# EAGLE design Main_Board_2X-SOLAR_5V-DCDC (EAGLE 8.2.2)
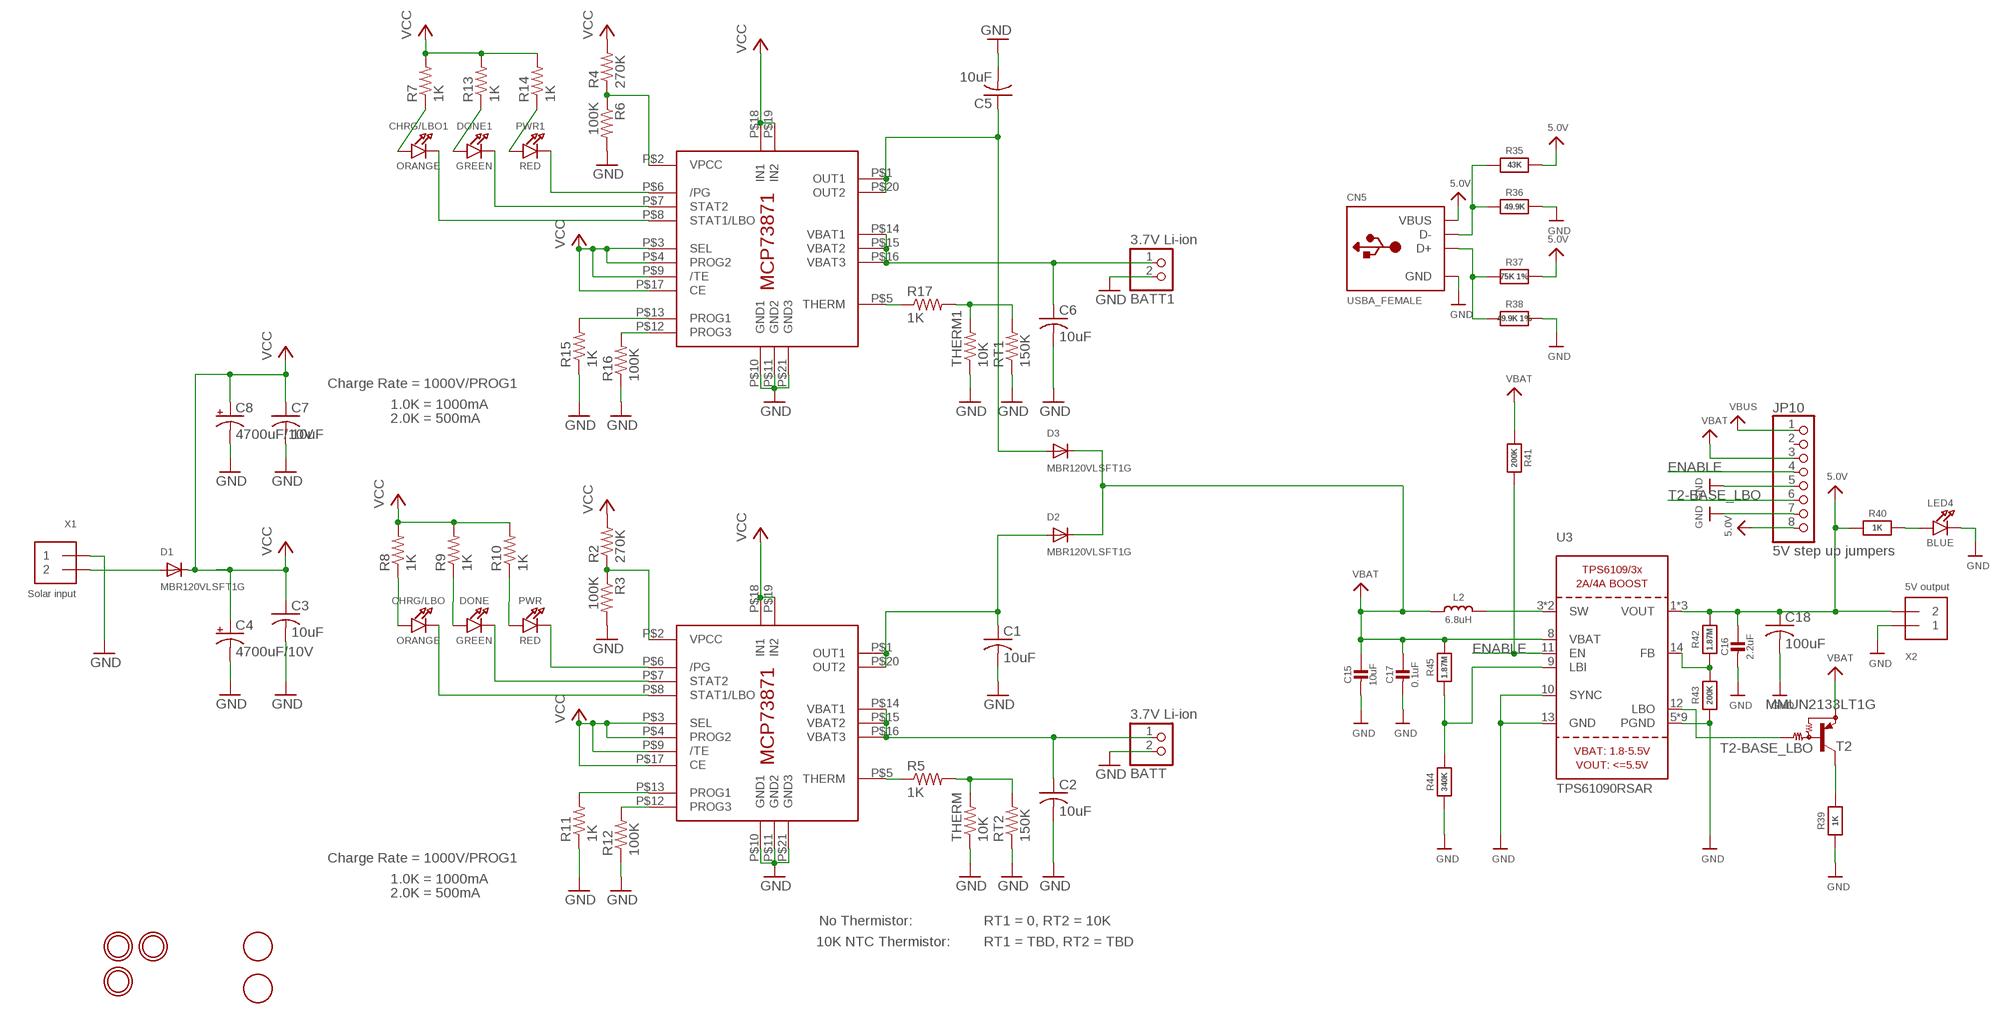
[diagram p0: schematic, sheet 1]

## Parts
BATT  3.7V Li-ion  JST_2PIN-SMT-RA  [JST-PH-2-SMT-RA]
BATT1  3.7V Li-ion  JST_2PIN-SMT-RA  [JST-PH-2-SMT-RA]
C1  10uF  C-USC0805K  [C0805K]
C2  10uF  C-USC0805K  [C0805K]
C3  10uF  C-USC0805K  [C0805K]
C4  4700uF/10V  CPOL-USE5-13  [E5-13]
C5  10uF  C-USC0805K  [C0805K]
C6  10uF  C-USC0805K  [C0805K]
C7  10uF  C-USC0805K  [C0805K]
C8  4700uF/10V  CPOL-USE5-13  [E5-13]
C15  10uF  CAP_CERAMIC0805-NOOUTLINE  [0805-NO]
C16  2.2uF  CAP_CERAMIC0805-NOOUTLINE  [0805-NO]
C17  0.1uF  CAP_CERAMIC0805_10MGAP  [0805_10MGAP]
C18  100uF  C-USC1210  [C1210]
CHRG/LBO  ORANGE  LED0805_NOOUTLINE  [CHIPLED_0805_NOOUTLINE]
CHRG/LBO1  ORANGE  LED0805_NOOUTLINE  [CHIPLED_0805_NOOUTLINE]
CN5  USBA_FEMALE  USB_TYPEAPTHFML  [USB_HOST-PTH]
D1  MBR120VLSFT1G  DIODESOD-123  [SOD-123]
D2  MBR120VLSFT1G  DIODESOD-123  [SOD-123]
D3  MBR120VLSFT1G  DIODESOD-123  [SOD-123]
DONE  GREEN  LED0805_NOOUTLINE  [CHIPLED_0805_NOOUTLINE]
DONE1  GREEN  LED0805_NOOUTLINE  [CHIPLED_0805_NOOUTLINE]
IC1  MCP73871  [QFN20_4MM]
IC2  MCP73871  [QFN20_4MM]
JP10  5V step up jumpers  HEADER-1X8ROUND  [1X08_ROUND]
L2  6.8uH  INDUCTORTDK_VLC5045  [INDUCTOR_5X5MM_TDK_VLC5045]
LED4  BLUE  LED0805_NOOUTLINE  [CHIPLED_0805_NOOUTLINE]
PWR  RED  LED0805_NOOUTLINE  [CHIPLED_0805_NOOUTLINE]
PWR1  RED  LED0805_NOOUTLINE  [CHIPLED_0805_NOOUTLINE]
R2  270K  R-US_R0805  [R0805]
R3  100K  R-US_R0805  [R0805]
R4  270K  R-US_R0805  [R0805]
R5  1K  R-US_M0805  [M0805]
R6  100K  R-US_R0805  [R0805]
R7  1K  R-US_R0805  [R0805]
R8  1K  R-US_R0805  [R0805]
R9  1K  R-US_R0805  [R0805]
R10  1K  R-US_R0805  [R0805]
R11  1K  R-US_FLIPFLOP  [0805-THM]
R12  100K  R-US_R0805  [R0805]
R13  1K  R-US_R0805  [R0805]
R14  1K  R-US_R0805  [R0805]
R15  1K  R-US_FLIPFLOP  [0805-THM]
R16  100K  R-US_R0805  [R0805]
R17  1K  R-US_M0805  [M0805]
R35  43K  RESISTOR0805_NOOUTLINE  [0805-NO]
R36  49.9K  RESISTOR0805_NOOUTLINE  [0805-NO]
R37  75K 1%  RESISTOR0805_NOOUTLINE  [0805-NO]
R38  49.9K 1%  RESISTOR0805_NOOUTLINE  [0805-NO]
R39  1K  RESISTOR0805_NOOUTLINE  [0805-NO]
R40  1K  RESISTOR0805_NOOUTLINE  [0805-NO]
R41  200K  RESISTOR0805_NOOUTLINE  [0805-NO]
R42  1.87M  RESISTOR0805_NOOUTLINE  [0805-NO]
R43  200K  RESISTOR0805_NOOUTLINE  [0805-NO]
R44  340K  RESISTOR_0805MP  [_0805MP]
R45  1.87M  RESISTOR_0805MP  [_0805MP]
RT1  150K  R-US_M0805  [M0805]
RT2  150K  R-US_M0805  [M0805]
T2  MMUN2133LT1G  MUN2114T1-PNP_DRIVER-SC59-BEC  [SC59-BEC]
THERM  10K  R-US_FLIPFLOP  [0805-THM]
THERM1  10K  R-US_FLIPFLOP  [0805-THM]
U3  TPS61090RSAR  VREG_TPS6103X  [PVQFN-16]
U$1  MOUNTINGHOLE2.5  [MOUNTINGHOLE_2.5_PLATED]
U$3  FIDUCIAL  [FIDUCIAL_1MM]
U$4  MOUNTINGHOLE2.5  [MOUNTINGHOLE_2.5_PLATED]
U$6  MOUNTINGHOLE2.5  [MOUNTINGHOLE_2.5_PLATED]
U$8  FIDUCIAL  [FIDUCIAL_1MM]
X1  Solar input  TERMBLOCK_1X2  [TERMBLOCK_1X2-3.5MM]
X2  5V output  TERMBLOCK_1X2  [TERMBLOCK_1X2-3.5MM]

## Nets
5.0V: C16.1 C18.1 CN5.VBUS JP10.8 R35.2 R37.2 R40.1 R42.2 U3.1(VOUT) U3.15(VOUT) U3.16(VOUT) X2.2
BATT: BATT.1 C2.1 IC1.P$14(VBAT1) IC1.P$15(VBAT2) IC1.P$16(VBAT3)
BATT1: BATT1.1 C6.1 IC2.P$14(VBAT1) IC2.P$15(VBAT2) IC2.P$16(VBAT3)
D+1: CN5.D+ R37.1 R38.1
D-1: CN5.D- R35.1 R36.1
ENABLE: JP10.4 R41.2 U3.11(EN)
GND: BATT1.2 BATT.2 C1.2 C2.2 C3.2 C4.- C5.2 C6.2 C7.2 C8.- C15.2 C16.2 C17.2 C18.2 CN5.GND IC1.P$10(GND1) IC1.P$11(GND2) IC1.P$21(GND3) IC2.P$10(GND1) IC2.P$11(GND2) IC2.P$21(GND3) JP10.5 JP10.7 LED4.C R3.2 R6.2 R11.1 R12.1 R15.1 R16.1 R36.2 R38.2 R39.1 R43.1 R44.1 RT1.1 RT2.1 THERM1.1 THERM.1 U3.5(PGND) U3.6(PGND) U3.7(PGND) U3.10(SYNC) U3.13(GND) U3.P$18(PGND) U3.P$19(PGND) U3.P$20(PGND) U3.P$21(PGND) U3.P$22(PGND) U3.THERMAL(PGND) X1.1 X2.1
LBI: R44.2 R45.1 U3.9(LBI)
N$5: IC1.P$5(THERM) R5.1
N$8: R5.2 RT2.2 THERM.2
N$12: CHRG/LBO.A R8.1
N$13: DONE.A R9.1
N$14: PWR.A R10.1
N$19: CHRG/LBO1.A R7.1
N$20: DONE1.A R13.1
N$21: PWR1.A R14.1
N$24: IC2.P$5(THERM) R17.1
N$25: R17.2 RT1.2 THERM1.2
N$42: R42.1 R43.2 U3.14(FB)
N$44: LED4.A R40.2
PG: IC1.P$6(/PG) PWR.C
PG_1: IC2.P$6(/PG) PWR1.C
PROG1: IC1.P$13(PROG1) R11.2
PROG1_1: IC2.P$13(PROG1) R15.2
PROG3: IC1.P$12(PROG3) R12.2
PROG3_1: IC2.P$12(PROG3) R16.2
PV_IN: D1.A X1.2
STAT1: CHRG/LBO.C IC1.P$8(STAT1/LBO)
STAT1_1: CHRG/LBO1.C IC2.P$8(STAT1/LBO)
STAT2: DONE.C IC1.P$7(STAT2)
STAT2_1: DONE1.C IC2.P$7(STAT2)
SW: L2.P$2 U3.3(SW) U3.4(SW)
T2-BASE_LBO: JP10.6 T2.B U3.12(LBO)
T2-DRAIN: R39.2 T2.C
VBAT: C15.1 C17.1 D2.C D3.C JP10.3 L2.P$1 R41.1 R45.2 T2.E U3.8(VBAT)
VBUS: JP10.1
VCC: C3.1 C4.+ C7.1 C8.+ D1.C IC1.P$3(SEL) IC1.P$4(PROG2) IC1.P$9(/TE) IC1.P$17(CE) IC1.P$18(IN1) IC1.P$19(IN2) IC2.P$3(SEL) IC2.P$4(PROG2) IC2.P$9(/TE) IC2.P$17(CE) IC2.P$18(IN1) IC2.P$19(IN2) R2.2 R4.2 R7.2 R8.2 R9.2 R10.2 R13.2 R14.2
VOUT: C1.1 D2.A IC1.P$1(OUT1) IC1.P$20(OUT2)
VOUT1: C5.1 D3.A IC2.P$1(OUT1) IC2.P$20(OUT2)
VPCC: IC1.P$2(VPCC) R2.1 R3.1
VPCC1: IC2.P$2(VPCC) R4.1 R6.1
Unconnected: JP10.2

## Notes on the sheet
- Charge Rate = 1000V/PROG1
- 1.0K = 1000mA
- 2.0K = 500mA
- Charge Rate = 1000V/PROG1
- 1.0K = 1000mA
- 2.0K = 500mA
- No Thermistor: | RT1 = 0, RT2 = 10K
- 10K NTC Thermistor: | RT1 = TBD, RT2 = TBD

## Library data of the parts
BATT BATT1 = adafruit:JST_2PIN: JST 2-Pin Connectors of various flavors SMT-RA (S2B-PH-SM4) 4UConnector #17311 SMT (B2B-PH-SM4) THM-RA (S2B-PH) THM (B2B-PH)
C1-C3 C5-C7 = adafruit:C-US: CAPACITOR, American symbol
C4 C8 = adafruit:CPOL-US: POLARIZED CAPACITOR, American symbol
C15-C17 = microbuilder:CAP_CERAMIC: Ceramic Capacitors For new designs, use the packages preceded by an '_' character since they are more reliable: The following footprints should be used on most boards: _0402 - Standard footprint for regular board layouts _0603 - Standard footprint for regular board layouts _0805 - Standard footprint for regular board layouts _1206 - Standard footprint for regular board layouts For extremely tight-pitch boards where space is at a premium, the following 'micro-pitch' footprints can be used (smaller pads, no silkscreen outline, etc.): _0402MP - Micro-pitch footprint for very dense/compact boards _0603MP - Micro-pitch footprint for very dense/compact boards _0805MP - Micro-pitch footprint for very dense/compact boards _1206MP - Micro-pitch footprint for very dense/compact boards
C18 = rcl:C-US: CAPACITOR, American symbol
CHRG/LBO CHRG/LBO1 DONE DONE1 LED4 PWR PWR1 = microbuilder:LED: LED 0603 - 0603 Surface Mount Package 2mA: Green LED - Low Power (3.9mcd, 2ma, 1.7Vf) - Digikey: 475-2709-2-ND Orange LED - Low Power (9.8mcd, 2ma, 1.8Vf) - Digikey: 475-1194-2-ND Red LED - Low Power (5mcd, 2ma, 1.8Vf) - Digikey: 475-1195-2-ND Yellow LED - Low Power (7mcd, 2ma, 1.8Vf) - Digikey: 475-1196-2-ND 5mA: Blue LED - Low Power (17mcd, 5ma, 2.9Vf) - Digikey: LNJ937W8CRACT-ND 0805 - 0805 Surface Mount Package 2mA: Red LED (8.8mcd, 2mA, 1.8Vf, Clear) - Low Power [Digikey: 475-2510-1-ND] Green LED (5mcd, 2mA, 1.8Vf, Clear) - Low Power [Digikey: 475-2730-1-ND] Yellow LED (11.3mcd, 2mA, 1.8Vf, Clear) - Low Power [Digikey: 475-2555-1-ND] 20mA: Red LED (104mcd, 20mA, Diffused) - LS R976 [Digikey: 475-1278-6-ND] Red LED (12mcd, 20mA, 2.0Vf, Clear) - APT2012EC [Digikey: 754-1128-1-ND] Green LED (15mcd, 20mA, 2.2Vf, Clear) - APT2012GC [Digikey: 754-1131-1-ND] Orange LED (160mcd, 20mA, 2.1Vf, Clear) - APT2012SECK [Digikey: 754-1130-1-ND] 1206 - 1206 Surface Mount Package Green LED (26mcd, 20mA, Diffused) - LG N971 [Digikey: 475-1407-6-ND] Red LED (15mcd, 20mA, Diffused) - LH N974 [Digikey: 475-1416-6-ND] Cree - Cree High-Power Surface Mount LEDs XPEBWT-L1-0000-00D50 - White 111lm 350mA 2.9Vf 6200K 110° XTEAWT-00-0000-00000LEE3 - White 114lm 350mA 2.85Vf 5000K 115° Everlight - Everlight 45-21 Series Surface Mount LEDs 45-21/QK2C-B2832AC2CB2/2T - Warm White 2000mcd 20mA 3.25Vf 3050K 120° 45-21/LK2C-B38452C4CB2/2T - Nuetral White 2000mcd 20mA 3.25Vf 4150K 120° 45-21/LK2C-B50634C6CB2/2T - Cold White 2200mcd 20mA 3.25Vf 5650K 120° PLCC2 Reverse Mount LS T77K-J1L2-1-0-2-R18-Z - Red 11.25mcd 2mA 1.8Vf 630nm 120° LO T77K-L1M2-24-Z - Orange 19.6mcd 2mA 1.8Vf 606nm 120° LY T77K-K2M1-26-Z - Yellow 15.7mcd 2mA 1.8Vf 587nm 120°
CN5 = microbuilder:USB_TYPEA: USB - Type A Connectors Male types stick out and are inserted into a PC or matching females parts (these are the connectors used on USB Memory Sticks, etc.). Female parts are generally used for USB Host and accept a male-type connector. SMT - 4UCON: 10017 PTHFML - Digikey: 609-1045-ND, 4UCon: 05241 PCB - Use 2.0mm thick PCBs with this footprint
D1-D3 = microbuilder:DIODE: Diode SMA Model Volts Amps Type Vf Vr Digikey # Notes SSA34-E3 40V 3A Schottky 480mV @ 3A 200uA @ 40V SSA34-E3/61TGITR-ND CDBA120-G 20V 1A Schottky 500mV @ 1A 500uA @ 20V 641-1014-6-ND REEL MBRA210 10V 2A Schottky 350mV @ 2A 700uA @ 10V MBRA210LT3 SOD-123 Model Volts Amps Type Vf Vr Order # Notes BAT54T1G 30V 200mA Schottky 800mV @ 200mA 2uA @ 25V BAT54T1GOSTR-ND B0530W 30V 500mA Schottky 430mV @ 500mA 130uA @ 30V B0530W-FDICT-ND REEL MBR120 20V 1A Schottky 340mV @ 1A MBR120VLSFT1GOSCT-ND SOD-323 Model Volts Amps Type Vf Vr Order # Notes PMEG2005EJ 20V 500mA Schottky 355mV @ 500mA 568-4110-1-ND ZLLS410 10V 570mA Schottky 380mV @ 570mA ZLLS410CT-ND 1N4148WS 75V 150mA Silicon/Simple 1V 1N4148WSFSCT-ND REEL SOD-523 Model Volts Amps Type Vf Vr Order # Notes BAT54XV2 30V 200mA Schottky 0.8V @ 100mA BAT54XV2CT-ND TB751S 30V 30mA Schottky RB751S-40TE61CT-ND SOT23-R/W (R = Solder Paste/Reflow Ovens, W = Hand-Soldering) Model Volts Amps Type Vf Vr Order # Notes BAT54FILM 40V 300mA Schottky 497-7162-1-ND
IC1 IC2 = adafruit:MCP73871
JP10 = microbuilder:HEADER-1X8: PIN HEADER
L2 = microbuilder:INDUCTOR: Inductors 0603: 10nH Ceramic Inductor - microwire antenna/RF (Digikey: 712-1434-2-ND) 0805: 560nH Ceramic Inductor - RF (Digikey: 553-1047-1-ND) 270nH Ceramic Inductor - Q = 40@250MHz, +-5%, 1 Ohm DC Resistance (Digikey: 535-10506-2-ND) 1007 (2518 Metric) SMT: 10µH 10% 250mOhm 820mA 1007 Inductor (Digikey: 587-2189-1-ND) 22µH 10% 500mOhm 580mA 1007 Inductor (Digikey: 587-2190-1-ND) 47µH 10% 950mOhm 420mA 1007 Inductor (Digikey: 587-2191-1-ND) 47µH 5% 100mOhm 1A 1008 Inductor (Digikey: 732-1816-1-ND) 5.0x5.0mm (Taiyo Yuden NR5040 Series) 6.8µH 20% 2.3A 64mOhm Inductor (Digikey: 587-2374-2-ND) 5.0x5.0mm (TDK VLC5045 Series) 4.7µH 20% 3.3A 34mOhm Inductor (Digikey: 445-6526-1-ND) 6.8µH 20% 2.7A 46mOhm Inductor (Digikey: 445-6527-1-ND) 6.0x6.0mm (TDK VLC6045 Series) 4.7µH 20% 3.8A 27mOhm Inductor (Digikey: 445-6538-2-ND) 6.8µH 20% 3A 41mOhm Inductor (Digikey: 445-6540-1-ND) 6.2µH 30% 2.2A 45mOhm Inductor (Digikey: SRR5028-6R2YCT-ND) - Not TDK VLC6045 but footprint should match 6.0x6.0mm (TDK SLF6045 Series) 6.8uH 30% 2A 33mOhm Inductor (Digikey: 445-4572-1-ND, Mouser: 810-SLF645T6R8N2R0PF) 6.0x6.0mm (Sumida CDRH5D28 Series) 6.2uH 30% 1.8A 45mOhm Inductor (Digikey: 308-1542-1-ND) Taiyo Yuden NR3015T2R2M - 2.2uH 20% 1.5A (Digikey: 587-1648-2-ND, Mouser: 963-NR3015T2R2M) - Used with TI TPS62172 CoilCraft RFID Transponder Coil - MA5532-AE (For use with AS3935 Lightning Sensor) Vishay IHLP 1.0uH Molded Inductor - 24mOhm DCR, 5A, +/-20%, -55°C-125°C (Digikey: 541-1319-1-ND)
R2-R17 RT1 RT2 THERM THERM1 = adafruit:R-US_: RESISTOR, American symbol
R35-R45 = microbuilder:RESISTOR: Resistors For new designs, use the packages preceded by an '_' character since they are more reliable: The following footprints should be used on most boards: _0402 - Standard footprint for regular board layouts _0603 - Standard footprint for regular board layouts _0805 - Standard footprint for regular board layouts _1206 - Standard footprint for regular board layouts For extremely tight-pitch boards where space is at a premium, the following 'micro-pitch' footprints can be used (smaller pads, no silkscreen outline, etc.): _0402MP - Micro-pitch footprint for very dense/compact boards _0603MP - Micro-pitch footprint for very dense/compact boards _0805MP - Micro-pitch footprint for very dense/compact boards _1206MP - Micro-pitch footprint for very dense/compact boards
T2 = transistor:*-PNP_DRIVER-: PNP Bias Resistor Transistor
U3 = microbuilder:VREG_TPS6103X: TPS6103x 4A Boost - 1.8-5.5V Input, Adjustable Output to 5.5V
U$1 U$4 U$6 = microbuilder:MOUNTINGHOLE: Mounting Hole For #2 screws (0.086"/2.18mm width, 0.094"/2.4mm hole) use 2.5mm
U$3 U$8 = adafruit:FIDUCIAL: For use by pick and place machines to calibrate the vision/machine, 1mm By microbuilder.eu
X1 X2 = microbuilder:TERMBLOCK_1X2: 3.5mm Terminal block http://www.ladyada.net/library/pcb/eaglelibrary.html

## Net classes
0 default: clearance 0.205 mm

## Board
Rainforest Connection Power Board Rev 1
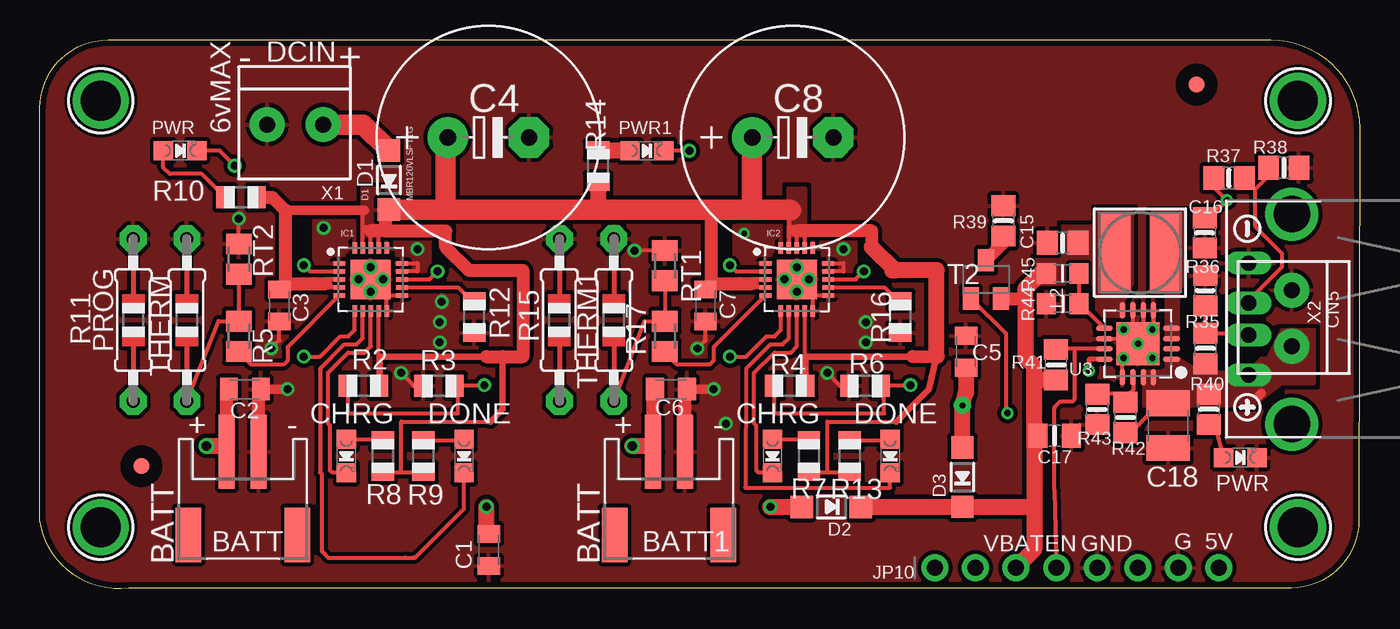
[diagram p1: board, top side]
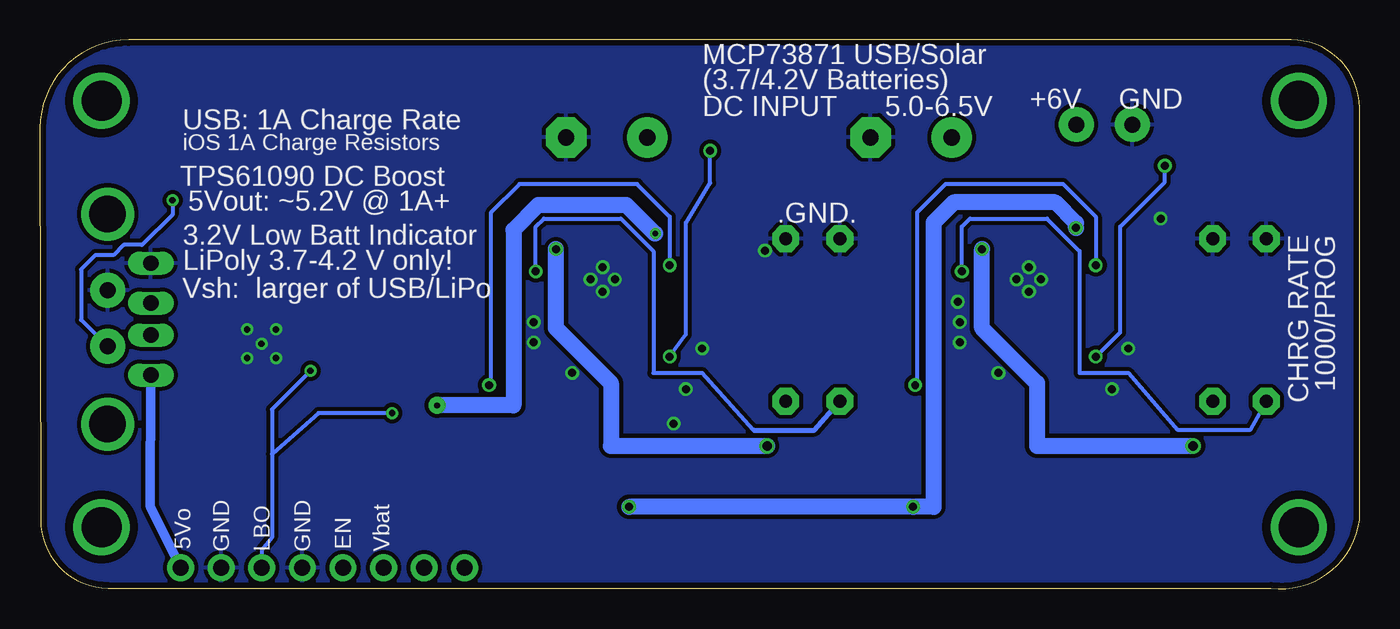
[diagram p2: board, bottom side, seen from below]

Size 82.59 x 34.33 mm. Coordinates in mm from the lower left corner, seen from the top.
Outline: 0,4.31 0,30.08 arc-90 4.27,34.33 77.05,34.33 arc-90 82.59,28.81 82.55,4.31 arc-90 78.32,0.04 5.54,0.04 arc-90 0,4.31
Copper layers (1*16): Top 0.0356mm / dielectric 1.5011mm / Bottom 0.0356mm
Design rules "oshpark-2layer": minimum track width 6mil, minimum drill 13mil, track to track 6mil, track to pad 6mil, pad to pad 6mil, via to via 6mil, smd to smd 6mil, copper to edge 15mil, drill to drill 6mil, minimum pad ring 7mil, minimum via ring 7mil, stop-mask expansion 2.5mil, vias tented up to drill 0mil, thermal gap 10mil
tRestrict: area 18.5,19 to 18.9,19.2; area 45.2,19 to 45.6,19.2; 18 lines

### Footprints (pad centres in the part's own frame; a part is rotated, then mirrored left to right if it is on the bottom)
JST-PH-2-SMT-RA = smd 1 x 4.6: 1 1,-3.7; 2 -1,-3.7 | smd 1.6 x 3.4: NC1 -3.4,1.5; NC2 3.4,1.5
C0805K = smd 1.1 x 1.4: 1 -1,0; 2 1,0
E5-13 = drill 1.016 pad 2.54: + -2.54,0 | drill 1.016 pad 2.54 octagon: - 2.54,0
0805-NO = smd 1.3 x 1.5: 1 -0.95,0; 2 0.95,0
0805_10MGAP = smd 1.2 x 1.5: 1 -1.05,0; 2 1.05,0
C1210 = smd 1.6 x 2.7: 1 -1.4,0; 2 1.4,0
CHIPLED_0805_NOOUTLINE = smd 1.2 x 1.2: A 0,-1.05; C 0,1.05
USB_HOST-PTH = drill 0.95 long: D+ 1,6.52; D- -1,6.52; GND 3.5,6.52; VBUS -3.5,6.52 | drill 2.3 pad 2.9: S1 -6.57,3.81; S2 6.57,3.81
SOD-123 = smd 1.4 x 1.4: A 1.85,0; C -1.85,0
QFN20_4MM = smd 0.73 x 0.28: P$1 -1.965,1; P$2 -1.965,0.5; P$3 -1.965,0; P$4 -1.965,-0.5; P$5 -1.965,-1; P$11 1.965,-1; P$12 1.965,-0.5; P$13 1.965,0; P$14 1.965,0.5; P$15 1.965,1 | smd 0.28 x 0.73: P$6 -1,-1.965; P$7 -0.5,-1.965; P$8 0,-1.965; P$9 0.5,-1.965; P$10 1,-1.965; P$16 1,1.965; P$17 0.5,1.965; P$18 0,1.965; P$19 -0.5,1.965; P$20 -1,1.965 | smd 2.5 x 2.5: P$21 0,0
1X08_ROUND = drill 1 pad 1.676: 1 -8.89,0; 2 -6.35,0; 3 -3.81,0; 4 -1.27,0; 5 1.27,0; 6 3.81,0; 7 6.35,0; 8 8.89,0
INDUCTOR_5X5MM_TDK_VLC5045 = smd 2 x 5: P$1 -1.6,0; P$2 1.6,0
R0805 = smd 1.1 x 1.4: 1 -1,0; 2 1,0
M0805 = smd 1.3 x 1.6: 1 -0.95,0; 2 0.95,0
0805-THM = drill 0.813 pad 1.676 octagon: 1 -5.08,0; 2 5.08,0
_0805MP = smd 1.2 x 1.3: 1 -1.016,0; 2 1.016,0
SC59-BEC = smd 1 x 1.4: B -0.95,-1.2; C 0,1.2; E 0.95,-1.2
PVQFN-16 = smd 1.05 x 0.35: 1 -2.1,0.975; 2 -2.1,0.325; 3 -2.1,-0.325; 4 -2.1,-0.975; 9 2.1,-0.975; 10 2.1,-0.325; 11 2.1,0.325; 12 2.1,0.975 | smd 0.35 x 1.05: 5 -0.975,-2.1; 6 -0.325,-2.1; 7 0.325,-2.1; 8 0.975,-2.1; 13 0.975,2.1; 14 0.325,2.1; 15 -0.325,2.1; 16 -0.975,2.1 | drill 0.4: P$18 0,0; P$19 -0.9,0.9; P$20 0.9,0.9; P$21 0.9,-0.9; P$22 -0.9,-0.9 | smd 2.7 x 2.7: THERMAL 0,0
MOUNTINGHOLE_2.5_PLATED = drill 2.5 pad 3.2: P$1 0,0
FIDUCIAL_1MM = smd 1 x 1: 1 0,0
TERMBLOCK_1X2-3.5MM = drill 1 pad 2.184: 1 1.8,0; 2 -1.7,0

### Placement (x,y rotation side)
BATT  12.7,4.86 180 top
BATT1  39.37,4.86 180 top
C1  28.09,2.43 270 top
C2  12.83,12.48 0 top
C3  14.99,17.72 270 top
C4  28.07,28.23 0 top
C5  57.96,14.82 90 top
C6  39.5,12.48 0 top
C7  41.66,17.72 270 top
C8  47.12,28.23 0 top
C15  64.01,21.63 180 top
C16  72.9,22.26 270 top
C17  63.5,9.56 0 top
C18  70.61,10.2 270 top
CHRG/LBO  19.18,8.29 180 top
CHRG/LBO1  45.85,8.29 180 top
CN5  82.17,16.87 90 top
D1  21.84,25.56 90 top
D2  49.53,5.12 180 top
D3  57.73,6.97 90 top
DONE  26.54,8.29 180 top
DONE1  53.21,8.29 180 top
IC1  20.7,19.34 0 top
IC2  47.37,19.34 0 top
JP10  64.9,1.31 0 top
L2  68.85,21.02 0 top
LED4  75.12,8.2 270 top
PWR  8.78,27.4 270 top
PWR1  37.99,27.39 270 top
R2  20.26,12.69 0 top
R3  24.97,12.69 180 top
R4  46.93,12.69 0 top
R5  12.45,15.79 90 top
R6  51.64,12.69 180 top
R7  48.13,8.29 270 top
R8  21.46,8.29 270 top
R9  24,8.29 270 top
R10  12.59,24.48 0 top
R11  5.84,16.8 270 top
R12  27.18,17.01 90 top
R13  50.67,8.29 270 top
R14  34.94,26.44 270 top
R15  32.51,16.8 270 top
R16  53.85,17.01 90 top
R17  39.12,15.79 90 top
R35  72.95,15.02 270 top
R36  72.93,18.64 90 top
R37  74.42,25.69 180 top
R38  77.85,26.33 0 top
R39  60.29,23.01 270 top
R40  73.15,11.21 270 top
R41  63.59,14.01 90 top
R42  67.94,10.71 270 top
R43  66.17,11.21 90 top
R44  64.01,17.82 0 top
R45  64.01,19.72 180 top
RT1  39.12,20.21 270 top
RT2  12.45,20.61 270 top
T2  59.21,19.34 0 top
THERM  9.19,16.8 270 top
THERM1  35.92,16.8 270 top
U3  68.72,15.32 180 top
U$1  78.74,30.52 0 top
U$3  72.39,31.53 0 top
U$4  3.81,3.85 0 top
U$6  3.81,30.52 0 top
U$8  6.35,7.66 0 top
U$12  MOUNTINGHOLE2.5  [MOUNTINGHOLE_2.5_PLATED]  78.74,3.85 0 top
U$86  [SYMBOL_PLUS]  75.56,11.34 0 top
U$87  [SYMBOL_MINUS]  75.56,22.52 90 top
X1  16.03,29.04 180 top
X2  78.36,16.87 90 top

### Tracks (layer width: path | path; a pad name or v marks a point on that pad's centre or on a via)
5.0V  (via drill 0.39)
  Top 0.254: 76.83,13.5 76.58,13.5 76.45,13.37 CN5.VBUS | R37.2 73.47,25.12 v74.3,24.29 73.21,23.21 C16.1 | R42.2 68.27,9.76 69.47,10.96 69.97,10.96 C18.1
  Top 0.61: 76.33,12.1 76.45,12.23
  Bottom 0.254: v74.3,24.29 74.3,23.41 76.2,21.5 77.34,21.5 77.98,20.87 79.12,20.87 80.01,19.98 80.01,16.82 X2.2
  Bottom 0.61: JP10.8 75.69,5.15 CN5.VBUS
  pour Top (isolate 0.254, no thermals): 69.09,13.63 69.09,11.47 75.95,11.47 77.72,12.86 79.76,12.86 79.76,16.17 77.72,16.17 76.83,14.39 76.45,14.39 75.56,13.5 72.64,13.5 71.25,14.39 70.48,14.39 70.48,13.63
BATT  (via drill 0.5, 0.6)
  Top 0.254: v23.62,21.25 23.62,21.5 | IC1.P$14 23.61,19.84 23.62,19.85 23.62,20.36 22.68,20.36 IC1.P$15
  Top 0.813: BATT.1 11.7,12.48 C2.1
  Top 1.016: v10.41,8.93 11.34,8.93 BATT.1
  Bottom 1.016: v23.62,21.25 23.62,16.29 20.19,12.86 20.19,8.93 v10.41,8.93
  pour Top: 21.72,21.25 21.72,22.26 24.38,22.26 24.38,19.85 22.35,19.85 22.35,21.25
BATT1  (via drill 0.5, 0.6)
  Top 0.254: v50.29,21.25 50.29,21.5 | IC2.P$14 50.28,19.84 50.29,19.85 50.29,20.36 49.35,20.36 IC2.P$15
  Top 0.813: BATT1.1 38.37,12.48 C6.1
  Top 1.016: v37.08,8.93 38.01,8.93 BATT1.1
  Bottom 1.016: v50.29,21.25 50.29,16.29 46.86,12.86 46.86,8.93 v37.08,8.93
  pour Top: 48.39,21.25 48.39,22.26 51.05,22.26 51.05,19.85 49.02,19.85 49.02,21.25
D+1
  Top 0.254: CN5.D+ 75.65,18.03 77.72,20.1 77.72,20.99 76.07,22.64 76.07,24.99 | R37.1 76.07,24.99 | R38.1 76.9,25.82 76.07,24.99
D-1
  Top 0.254: R36.1 72.93,15.99 R35.1 75.54,15.97 CN5.D-
ENABLE
  Top 0.254: U3.11 64.77,15 | 64.77,15 63.64,15 R41.2 | JP10.4 63.5,6.13 63.5,11.34 63.88,11.72 64.64,11.72 64.77,11.85 64.77,15
GND  (via drill 0.5)
  Top 0.254: 21.7,18.34 IC1.P$11 | IC1.P$10 21.7,18.31 | 21.7,18.31 21.72,18.33 | 22.65,13.45 v22.61,13.5 23.42,12.69 R3.2 | C3.2 14.99,15.53 v14.48,15.02 | RT2.1 v12.45,23.15 | 21.7,18.31 21.43,18.58 v20.7,18.58 | 48.37,18.34 IC2.P$11 | IC2.P$10 48.37,18.31 | 48.37,18.31 48.39,18.33 | 49.32,13.45 v49.28,13.5 50.09,12.69 R6.2 | C7.2 41.66,15.53 v41.15,15.02 | RT1.1 v37.21,21.14 | 48.37,18.31 48.1,18.58 v47.37,18.58 | U3.13 67.75,14.19 67.94,14.39 67.86,14.39 U3.P$20 | U3.10 68.06,15.65 68.07,15.66 67.82,15.91 U3.P$21 67.89,16.29 68.33,16.29 68.4,16.36 U3.7 | U3.6 69.05,16.08 69.22,15.91 | U3.5 69.7,16.3 U3.P$22
  Top 0.406: IC1.P$21 v21.46,19.34 | IC2.P$21 v48.13,19.34
  Top 0.61: C2.2 v15.49,12.48 | C6.2 v42.16,12.48
  Top 0.813: BATT.2 13.7,12.48 C2.2 | BATT1.2 40.37,12.48 C6.2
  other vias: 25.02,15.4 25.02,16.67 25.15,17.94 20.7,20.1 19.94,19.34 51.69,15.4 51.69,16.67 42.93,10.32 47.37,20.1 46.61,19.34
  pour Bottom (isolate 0.254): 0,0.04 0,34.33 82.55,34.33 82.55,0.04
  pour Top: 21.72,18.33 27.81,18.33 27.81,15.15 21.72,15.15
  pour Top: 48.39,18.33 54.48,18.33 54.48,15.15 48.39,15.15
  pour Top (isolate 0.254, rank 2): 0,-0.09 0,34.33 82.55,34.33 82.55,0.04
LBI
  Top 0.254: R45.1 R44.2 65.39,17.45 65.47,17.45 U3.9
N$5
  Top 0.254: IC1.P$5 15.49,15.1 15.49,14.26 15.24,14.01 13.21,14.01 12.45,14.77 R5.1
N$8
  Top 0.254: RT2.2 R5.2 11.18,16.74 THERM.2
N$12
  Top 0.254: CHRG/LBO.A 21.41,9.34 R8.1
N$13
  Top 0.254: R9.1 26.49,9.29 DONE.A
N$14
  Top 0.254: R10.1 10.13,25.95 8.13,25.95 7.73,26.34 PWR.A
N$19
  Top 0.254: CHRG/LBO1.A 48.08,9.34 R7.1
N$20
  Top 0.254: R13.1 53.16,9.29 DONE1.A
N$21
  Top 1.016: R14.1 36.9,27.44 PWR1.A
N$24
  Top 0.254: IC2.P$5 42.16,15.1 42.16,14.26 41.91,14.01 39.88,14.01 39.12,14.77 R17.1
N$25
  Top 0.254: RT1.2 R17.2 37.85,16.74 THERM1.2
N$42
  Top 0.254: 68.2,12.23 68.45,12.48 68.45,13.17 U3.14 | R43.2 66.17,12.23 68.2,12.23 | R42.1 67.94,11.98 68.2,12.23
N$44
  Top 0.254: R40.2 73.53,10.26 LED4.A
PG  (via drill 0.5)
  Top 0.254: v12.19,26.45 11.24,27.4 PWR.C | v16.51,14.52 17.53,14.52 18.8,15.79 19.3,15.79 19.7,16.18 IC1.P$6
  Bottom 0.254: v16.51,14.52 14.99,16.04 14.99,22.64 12.19,25.44 v12.19,26.45
PG_1  (via drill 0.5)
  Top 0.254: v40.64,27.39 PWR1.C | v43.18,14.52 44.2,14.52 45.47,15.79 45.97,15.79 46.37,16.18 IC2.P$6
  Bottom 0.254: v43.18,14.52 42.16,15.91 42.16,22.9 40.64,25.39 v40.64,27.39
PROG1  (via drill 0.5)
  Top 0.254: IC1.P$13 24.38,19.34 v24.89,19.85
  Bottom 0.254: v24.89,19.85 24.89,22.64 24.38,23.15 19.56,23.15 17.53,21.12 17.53,13.5 14.48,13.5 11.4,9.94 6.83,9.94 R11.2
PROG1_1  (via drill 0.5)
  Top 0.254: IC2.P$13 51.05,19.34 v51.56,19.85
  Bottom 0.254: v51.56,19.85 51.56,22.64 51.05,23.15 46.23,23.15 44.2,21.12 44.2,13.5 41.15,13.5 37.92,9.92
  Bottom 0.305: 37.92,9.92 34.11,9.92 R15.2
PROG3
  Top 0.254: IC1.P$12 26.17,18.84 27,18.01 R12.2
PROG3_1
  Top 0.254: IC2.P$12 52.84,18.84 53.67,18.01 R16.2
PV_IN
  Top 1.27: X1.2 20.22,29.04 D1.A
STAT1
  Top 0.254: IC1.P$8 20.7,15.15 20.32,14.77 19.3,14.77 18.03,13.5 18.03,10.32 18.16,10.2 18.16,7.4 18.29,7.28 19.14,7.28 CHRG/LBO.C 19.02,7.08
STAT1_1
  Top 0.254: IC2.P$8 47.37,15.15 46.99,14.77 45.97,14.77 44.7,13.5 44.7,10.32 44.83,10.2 44.83,7.4 44.96,7.28 45.81,7.28 CHRG/LBO1.C 45.69,7.08
STAT2
  Top 0.254: IC1.P$7 20.2,15.67 19.81,15.28 19.05,15.28 17.53,13.75 17.53,7.28 17.65,7.15 17.65,2.32 18.03,1.94 22.86,1.94 23.37,1.94 23.5,1.94 26.54,4.99 DONE.C
STAT2_1
  Top 0.254: IC2.P$7 46.87,15.67 46.48,15.28 45.72,15.28 44.2,13.75 44.15,6.31 53.21,6.31 DONE1.C
SW
  pour Top (isolate 0.254, no thermals): 70.48,15.66 71.25,15.66 71.25,18.58 71.5,18.96 71.5,23.53 69.6,23.53 69.6,18.58 70.48,18.58
T2-BASE_LBO  (via drill 0.39)
  Top 0.254: v65.66,13.63 65.9,13.63 | v60.55,10.98 60.46,10.99 60.45,15.99 T2.B
  Top 0.305: U3.12 65.66,14.35 v65.66,13.63
  Bottom 0.254: v65.66,13.63 68.07,11.21 68.07,8.42 | 68.07,8.42 68.07,3.21 68.71,2.4 JP10.6 | v60.55,10.98 65.15,10.98 68.07,8.42
T2-DRAIN
  Top 0.813: R39.2 60.24,21.56 T2.C
VBAT
  Top 0.813: 62.21,5.12 62.23,5.12 | T2.E 61.35,18.14 61.68,17.82
  Top 1.016: 62.23,10.2 62.23,12.74 | 62.23,8.93 62.23,10.2 | 62.23,8.93 62.23,5.12 62.23,2.45 JP10.3 | 62.23,12.74 62.23,13.91 61.68,14.46 61.68,17.82 61.68,18.76 62.64,19.72 R45.2 | D2.C 55.12,5.12 D3.C 62.21,5.12 | R41.1 62.55,13.06 62.23,12.74 | 62.23,10.2 62.45,9.98 C17.1 62.45,9.15 62.23,8.93
  pour Top (isolate 0.254, no thermals): 67.82,17.06 66.17,17.06 66.17,23.66 68.33,23.66 68.33,19.09 67.82,18.07
  pour Top (no thermals): 64.01,22.64 64.01,20.61 62.36,20.61 62.36,19.09 66.04,19.09 66.17,22.64
VCC
  Top 0.254: IC1.P$9 21.2,12.74 R2.2 | R9.2 R8.2 22.61,7.29 22.61,10.45 28.19,10.45 | IC1.P$3 17.91,19.34 17.91,19.09 | 20.57,22.39 20.57,22.64 20.2,22.64 IC1.P$19 20.2,23.54 20.32,23.66 | IC1.P$18 20.7,22.39 21.21,22.39 IC1.P$17 | IC1.P$4 17.39,18.84 arc-90 17.14,19.09 | IC2.P$9 47.87,12.74 R4.2 | R13.2 R7.2 49.28,7.29 49.28,10.45 53.59,10.45 | IC2.P$3 44.58,19.34 44.58,19.09 | 47.24,22.39 47.24,22.64 46.87,22.64 IC2.P$19 46.87,23.54 46.99,23.66 | IC2.P$18 47.37,22.39 47.88,22.39 IC2.P$17 | IC2.P$4 44.06,18.84 arc-90 43.81,19.09
  Top 0.406: R2.2 21.26,14.52 27.94,14.52 | 28.19,10.45 28.96,11.21 28.96,14.52 | R4.2 47.93,14.52 54.61,14.52 | 53.59,10.45 55.63,12.48 56.11,14.54
  Top 0.508: 42.29,19.09 41.92,18.72 C7.1 42.02,19.09
  Top 0.61: 20.32,23.66 15.35,23.66 | 43.19,23.67 44.64,23.72 arc-80 44.58,23.79
  Top 0.813: 17.91,19.09 17.14,19.09 15.62,19.09 15.26,18.72 C3.1 15.35,19.09 15.35,23.66 15.35,23.68 14.54,24.48 R10.2 | 21.59,22.39 25.4,22.39 25.4,21.37 26.87,19.9 30.23,19.9 30.23,14.52 28.96,14.52 27.94,14.52 | 21.59,22.39 20.7,22.39 | 42.29,19.09 43.81,19.09 44.58,19.09 | 43.29,23.68 43.19,23.67 42.02,23.66 42.02,19.09 | 52.07,21.37 52.07,22.39 47.37,22.39 | 54.61,14.52 56.11,14.54 | D1.C 21.59,23.46 21.59,22.39
  Top 1.016: 53.54,19.9 56.11,19.93 56.11,14.54 | 53.54,19.9 53.34,19.9 | 53.54,19.9 52.07,21.37 | R14.2 34.94,25.25 34.92,23.71
  Top 1.27: 41.91,23.72 39.74,23.71 34.92,23.71 32.13,23.71 25.4,23.71 | 42.55,23.72 41.91,23.72 | 42.55,23.72 43.57,23.72 arc-11 43.59,23.72 | C8.+ 44.58,23.79 | D1.C 25.4,23.71 | 25.4,23.71 25.4,27.6 C4.+ | 43.59,23.72 41.91,23.72 | 43.59,23.72 44.64,23.72 46.93,23.72 46.99,23.66 | 42.02,23.66 42.08,23.72 42.55,23.72
  pour Top: 20.19,21.18 20.19,25.06 21.21,25.06 21.21,21.18
  pour Top: 18.8,19.34 16.13,19.34 16.13,18.83 18.8,18.83
  pour Top: 46.86,21.18 46.86,25.06 47.88,25.06 47.88,21.18
  pour Top: 45.47,19.34 42.8,19.34 42.8,18.83 45.47,18.83
VOUT  (via drill 0.5)
  Top 1.016: v27.94,5.12 27.94,3.88 C1.1 | v45.72,5.12 D2.A
  Bottom 1.016: v17.75,22.57 17.75,22.87 19.05,24.17 25.4,24.17 26.67,22.9 26.67,5.12 v27.94,5.12 v45.72,5.12
  pour Top: 19.68,21.12 19.68,23.02 17.14,23.02 17.14,20.36 19.05,20.36 19.05,21.12
VOUT1  (via drill 0.35, 0.35 pad 1.05)
  Top 0.813: 57.94,13.46 C5.1
  Top 1.016: C5.1 57.96,12.28 v57.73,11.47 D3.A
  Bottom 1.016: v44.07,22.21 44.1,22.21 45.88,23.99 51.4,23.99 52.96,22.44 52.96,11.47 v57.73,11.47
  pour Top: 45.72,20.36 43.46,20.36 43.46,22.77 46.35,22.77 46.35,21.12 45.72,21.12
VPCC  (via drill 0.5)
  Top 0.254: IC1.P$2 16.9,19.84 v16.51,20.23 | 27.54,12.74 v27.81,12.74 25.97,12.74 R3.1 26.16,12.69 26.16,10.96 19.26,10.96 R2.1
  Bottom 0.254: v16.51,20.23 16.51,23.28 18.54,25.31 25.91,25.31 27.69,23.53 27.69,12.74 v27.81,12.74
VPCC1  (via drill 0.5)
  Top 0.254: IC2.P$2 43.57,19.84 v43.18,20.23 | 54.21,12.74 v54.48,12.74 52.64,12.74 R6.1 52.83,12.69 52.83,10.96 45.93,10.96 R4.1
  Bottom 0.254: v43.18,20.23 43.18,23.28 45.21,25.31 52.58,25.31 54.36,23.53 54.36,12.74 v54.48,12.74

### Text on the board
tPlace: DCIN | - | + | 6vMAX | D1 | PROG | CHRG | DONE | CHRG | DONE | PWR | BATT | BATT | VBAT | EN | GND | G | 5V
bPlace: MCP73871 USB/Solar | GND | +6V | (3.7/4.2V Batteries) | 5.0-6.5V | DC INPUT | USB: 1A Charge Rate | iOS 1A Charge Resistors | TPS61090 DC Boost | 5Vout: ~5.2V @ 1A+ | .GND. | 1000/PROG | CHRG RATE | 3.2V Low Batt Indicator | LiPoly 3.7-4.2 V only! | Vsh: larger of USB/LiPo | Vbat | EN | GND | LBO | GND | 5Vo